# Altium schematic sheet Sheet1.SchDoc
size A4
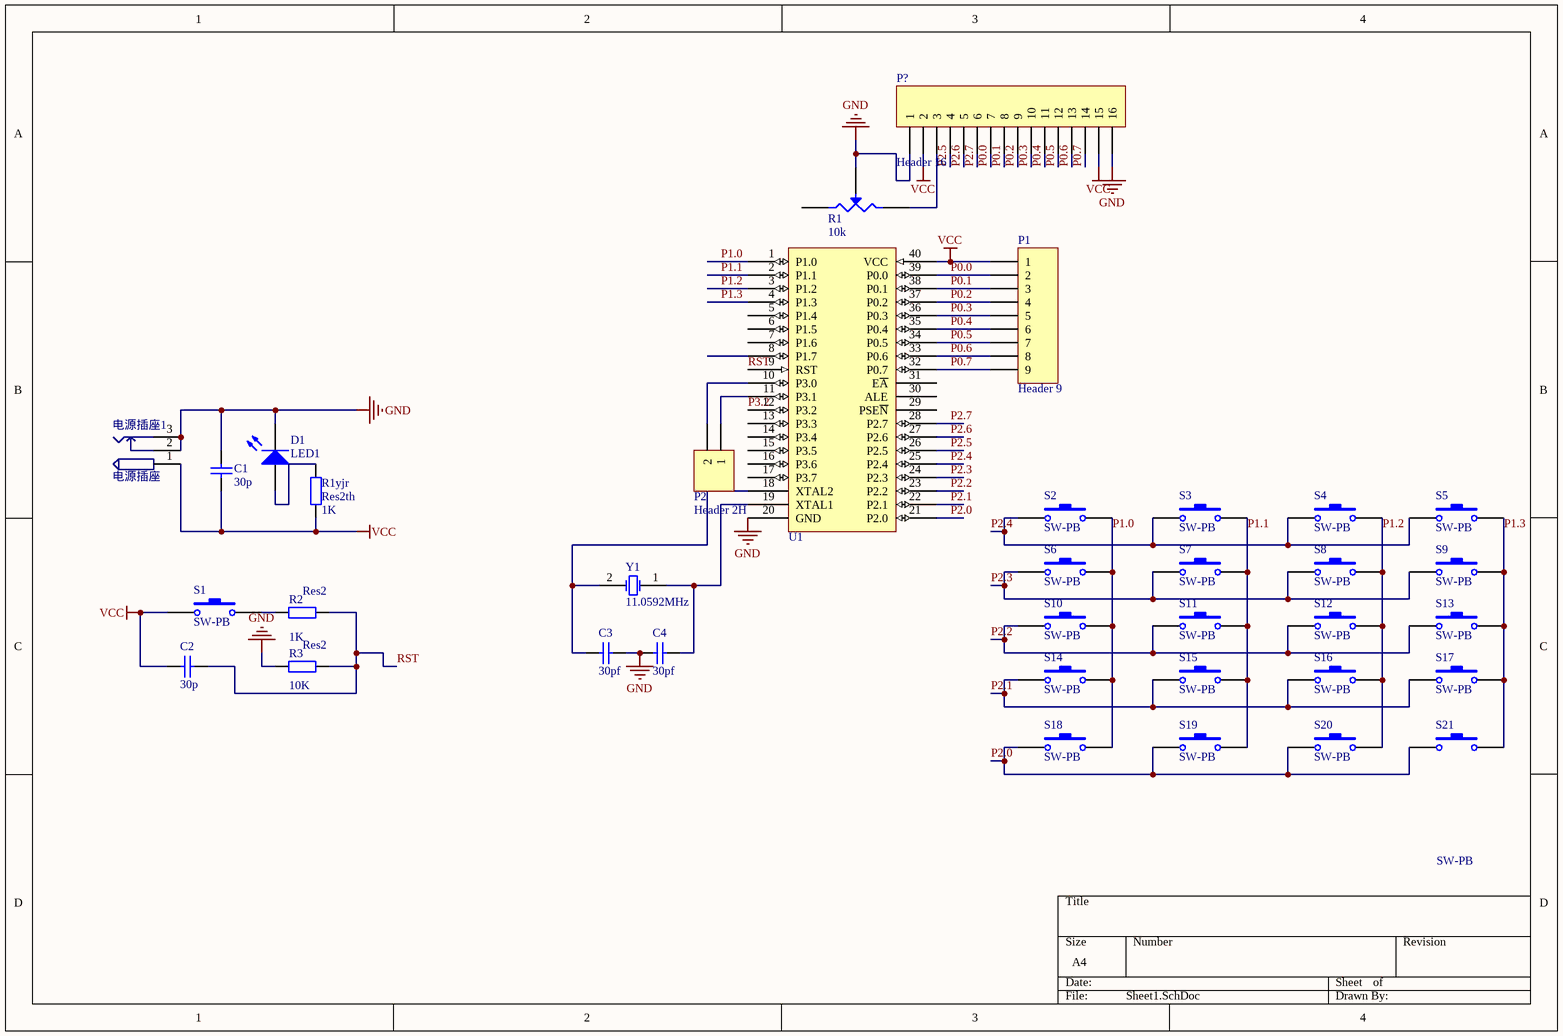
[diagram p0: Sheet1.SchDoc]

## Parts
C1  30p  [D104]
C2  30p  [D104]
C3  value 30pf  [RAD-0.3]  (hidden comment: Cap)
C4  value 30pf  [RAD-0.3]  (hidden comment: Cap)
D1  LED1  [LED-1]
P1  Header 9  [HDR1X9]
P2  Header 2H  [HDR1X2H]
P?  Header 16  [HDR1X16]
R1  10k  [VR-4]
R1yjr  Res2th  value 1K  [AXIAL-0.4]
R2  Res2  value 1K  [AXIAL-0.4]
R3  Res2  value 10K  [AXIAL-0.4]
S1  SW-PB  [6X6X?]
S2  SW-PB  [6X6X?]
S3  SW-PB  [6X6X?]
S4  SW-PB  [6X6X?]
S5  SW-PB  [6X6X?]
S6  SW-PB  [6X6X?]
S7  SW-PB  [6X6X?]
S8  SW-PB  [6X6X?]
S9  SW-PB  [6X6X?]
S10  SW-PB  [6X6X?]
S11  SW-PB  [6X6X?]
S12  SW-PB  [6X6X?]
S13  SW-PB  [6X6X?]
S14  SW-PB  [6X6X?]
S15  SW-PB  [6X6X?]
S16  SW-PB  [6X6X?]
S17  SW-PB  [6X6X?]
S18  SW-PB  [6X6X?]
S19  SW-PB  [6X6X?]
S20  SW-PB  [6X6X?]
S21  SW-PB  [6X6X?]
U1  AT89S52  [DIP40C]  (value not drawn)
Y1  11.0592MHz  [晶振]
电源插座1  电源插座  [DIANYUAN]

## Nets
GND: C1.2 C3.1 C4.2 D1.2(K) P?.1 P?.16 R1.3 R3.1 U1.20(GND) 电源插座1.2 电源插座1.3
VCC: C1.1 C2.1 P1.1 P?.2 P?.15 R1yjr.1 S1.1 U1.40(VCC) 电源插座1.1
P0.0: P1.2 P?.7 U1.39(P0.0)
P0.1: P1.3 P?.8 U1.38(P0.1)
P0.2: P1.4 P?.9 U1.37(P0.2)
P0.3: P1.5 P?.10 U1.36(P0.3)
P0.4: P1.6 P?.11 U1.35(P0.4)
P0.5: P1.7 P?.12 U1.34(P0.5)
P0.6: P1.8 P?.13 U1.33(P0.6)
P0.7: P1.9 P?.14 U1.32(P0.7)
P1.0: S2.2 S6.2 S10.2 S14.2 S18.2 U1.1(P1.0)
P1.1: S3.2 S7.2 S11.2 S15.2 S19.2 U1.2(P1.1)
P1.2: S4.2 S8.2 S12.2 S16.2 S20.2 U1.3(P1.2)
P1.3: S5.2 S9.2 S13.2 S17.2 S21.2 U1.4(P1.3)
P2.0: S18.1 S19.1 S20.1 S21.1 U1.21(P2.0)
P2.1: S14.1 S15.1 S16.1 S17.1 U1.22(P2.1)
P2.2: S10.1 S11.1 S12.1 S13.1 U1.23(P2.2)
P2.3: S6.1 S7.1 S8.1 S9.1 U1.24(P2.3)
P2.4: S2.1 S3.1 S4.1 S5.1 U1.25(P2.4)
P2.5: P?.4 U1.26(P2.5)
P2.6: P?.5 U1.27(P2.6)
P2.7: P?.6 U1.28(P2.7)
P3.2: U1.12(P3.2)
RST: C2.2 R2.2 R3.2 U1.9(RST)
NetC3_2: C3.2 U1.18(XTAL2) Y1.2(OSC2)
NetC4_1: C4.1 U1.19(XTAL1) Y1.1(OSC1)
NetD1_1: D1.1(A) R1yjr.2
NetP2_1: P2.1 U1.11(P3.1)
NetP2_2: P2.2 U1.10(P3.0)
NetP?_3: P?.3 R1.2
NetR2_1: R2.1 S1.2

Not connected (* = marked no-connect by the designer): R1 1; U1 5(P1.4) 6(P1.5) 7(P1.6) 8(P1.7) 13(P3.3) 14(P3.4) 15(P3.5) 16(P3.6) 17(P3.7) 29(PSE~{N}) 30(ALE) 31(E~{A})

## Library data of the parts
C1 C2 = Cap: Capacitor; Value: 33pF; Published: 8-Jun-2000; LatestRevisionDate: 17-Jul-2002; LatestRevisionNote: Re-released for DXP Platform.; PackageReference: RAD-0.3; Publisher: Altium Limited
C3 C4 = Cap: Capacitor; Published: 8-Jun-2000; LatestRevisionDate: 17-Jul-2002; LatestRevisionNote: Re-released for DXP Platform.; PackageReference: RAD-0.3; Publisher: Altium Limited; PackageDescription: Radial Cap, Thru-Hole; 2 Leads; 0.3 in Pin Spacing
D1 = LED1: Typical RED GaAs LED; Published: 8-Jun-2000; LatestRevisionDate: 08-Jul-2005; LatestRevisionNote: Mech Layer 1 removed.; PackageReference: LED-1; Publisher: Altium Limited
P1 = Header 9: Header, 9-Pin; LatestRevisionDate: 17-Jul-2002; LatestRevisionNote: Re-released for DXP Platform.; Publisher: Altium Limited
P2 = Header 2H: Header, 2-Pin, Right Angle; LatestRevisionDate: 17-Jul-2002; LatestRevisionNote: Re-released for DXP Platform.; Publisher: Altium Limited
P? = Header 16: Header, 16-Pin; LatestRevisionDate: 17-Jul-2002; LatestRevisionNote: Re-released for DXP Platform.; Publisher: Altium Limited
R1 = POT1: Potentiometer
R1yjr R2 R3 = Res2: Resistor; Published: 8-Jun-2000; LatestRevisionDate: 17-Jul-2002; LatestRevisionNote: Re-released for DXP Platform.; PackageReference: AXIAL-0.4; Publisher: Altium Limited; PackageDescription: Axial Device, Thru-Hole; 2 Leads; 0.4 in Pin Spacing
S1-S21 = SW-PB: Switch; Published: 24-Mar-1999; LatestRevisionDate: 17-Jul-2002; LatestRevisionNote: Re-released for DXP Platform.; PackageReference: SPST-2; Publisher: Altium Limited
Y1 = XTAL: Crystal Oscillator; Published: 8-Jun-2000; LatestRevisionDate: 17-Jul-2002; LatestRevisionNote: Re-released for DXP Platform.; PackageReference: R38; Publisher: Altium Limited